# EAGLE design untitled1 (EAGLE 5.07)
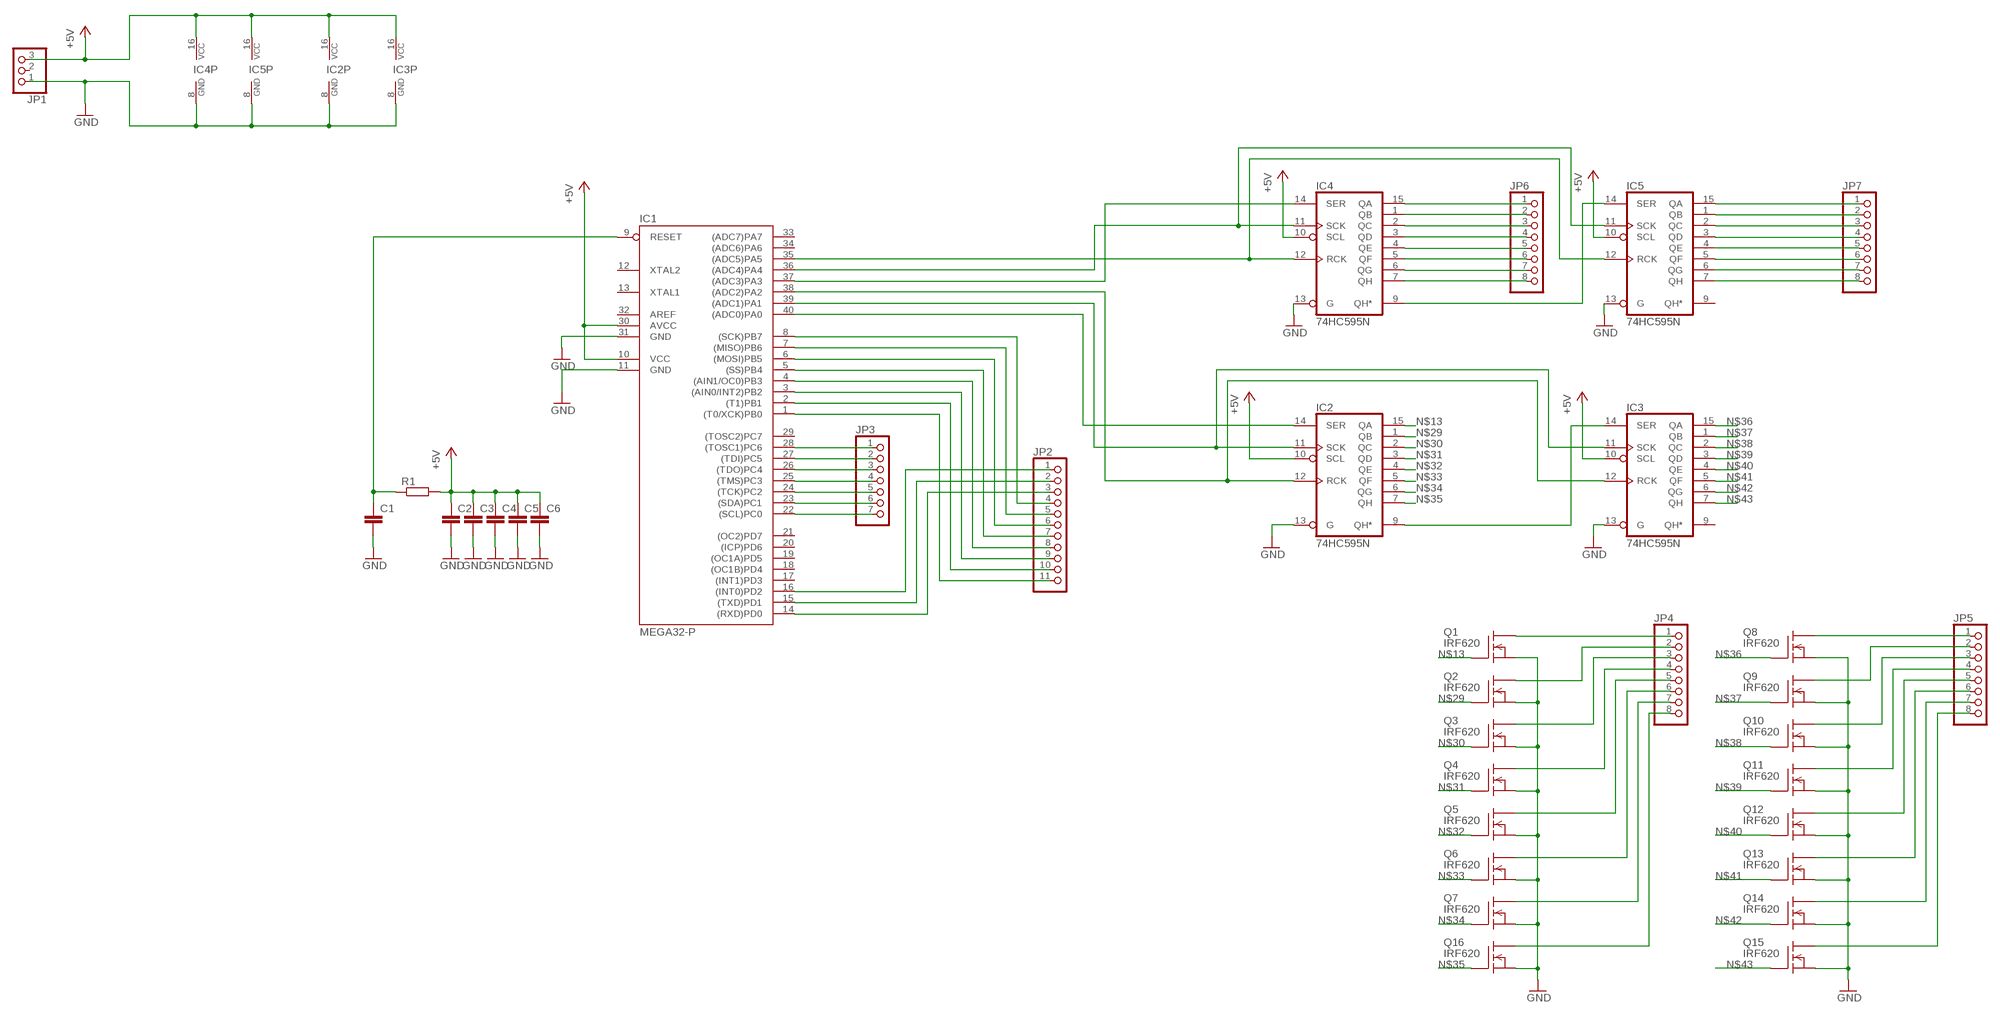
[diagram p0: schematic, sheet 1]

## Parts
C1  C-EU050-024X044  [C050-024X044]
C2  C-EU050-024X044  [C050-024X044]
C3  C-EU050-024X044  [C050-024X044]
C4  C-EU050-024X044  [C050-024X044]
C5  C-EU050-024X044  [C050-024X044]
C6  C-EU050-024X044  [C050-024X044]
IC1  MEGA32-P  [DIL40]
IC2  74HC595N  [DIL16]
IC3  74HC595N  [DIL16]
IC4  74HC595N  [DIL16]
IC5  74HC595N  [DIL16]
JP1  PINHD-1X3/90  [1X03/90]
JP2  PINHD-1X11/90  [1X11/90]
JP3  PINHD-1X7/90  [1X07/90]
JP4  PINHD-1X8/90  [1X08/90]
JP5  PINHD-1X8/90  [1X08/90]
JP6  PINHD-1X8/90  [1X08/90]
JP7  PINHD-1X8/90  [1X08/90]
Q1  IRF620  [TO220]
Q2  IRF620  [TO220]
Q3  IRF620  [TO220]
Q4  IRF620  [TO220]
Q5  IRF620  [TO220]
Q6  IRF620  [TO220]
Q7  IRF620  [TO220]
Q8  IRF620  [TO220]
Q9  IRF620  [TO220]
Q10  IRF620  [TO220]
Q11  IRF620  [TO220]
Q12  IRF620  [TO220]
Q13  IRF620  [TO220]
Q14  IRF620  [TO220]
Q15  IRF620  [TO220]
Q16  IRF620  [TO220]
R1  R-EU_0204/7  [0204/7]

## Nets
+5V: C2.1 C3.1 C4.1 C5.1 C6.1 IC1.10(VCC) IC1.30(AVCC) IC2.10(SCL) IC2.16(VCC) IC3.10(SCL) IC3.16(VCC) IC4.10(SCL) IC4.16(VCC) IC5.10(SCL) IC5.16(VCC) JP1.3 R1.2
GND: C1.2 C2.2 C3.2 C4.2 C5.2 C6.2 IC1.11(GND) IC1.31(GND) IC2.8(GND) IC2.13(G) IC3.8(GND) IC3.13(G) IC4.8(GND) IC4.13(G) IC5.8(GND) IC5.13(G) JP1.1 Q1.3(S) Q2.3(S) Q3.3(S) Q4.3(S) Q5.3(S) Q6.3(S) Q7.3(S) Q8.3(S) Q9.3(S) Q10.3(S) Q11.3(S) Q12.3(S) Q13.3(S) Q14.3(S) Q15.3(S) Q16.3(S)
N$1: IC2.9(QH*) IC3.14(SER)
N$2: IC1.40((ADC0)PA0) IC2.14(SER)
N$3: IC1.39((ADC1)PA1) IC2.11(SCK) IC3.11(SCK)
N$4: IC1.38((ADC2)PA2) IC2.12(RCK) IC3.12(RCK)
N$5: IC1.37((ADC3)PA3) IC4.14(SER)
N$6: IC1.36((ADC4)PA4) IC4.11(SCK) IC5.11(SCK)
N$7: IC1.35((ADC5)PA5) IC4.12(RCK) IC5.12(RCK)
N$8: IC4.9(QH*) IC5.14(SER)
N$9: C1.1 IC1.9(RESET) R1.1
N$10: IC1.14((RXD)PD0) JP2.3
N$11: IC1.15((TXD)PD1) JP2.2
N$12: IC1.16((INT0)PD2) JP2.1
N$13: IC2.15(QA) Q1.1(G)
N$14: IC1.8((SCK)PB7) JP2.4
N$15: IC1.7((MISO)PB6) JP2.5
N$16: IC1.6((MOSI)PB5) JP2.6
N$17: IC1.5((SS)PB4) JP2.7
N$18: IC1.4((AIN1/OC0)PB3) JP2.8
N$19: IC1.3((AIN0/INT2)PB2) JP2.9
N$20: IC1.2((T1)PB1) JP2.10
N$21: IC1.1((T0/XCK)PB0) JP2.11
N$22: IC1.22((SCL)PC0) JP3.7
N$23: IC1.23((SDA)PC1) JP3.6
N$24: IC1.24((TCK)PC2) JP3.5
N$25: IC1.25((TMS)PC3) JP3.4
N$26: IC1.26((TDO)PC4) JP3.3
N$27: IC1.27((TDI)PC5) JP3.2
N$28: IC1.28((TOSC1)PC6) JP3.1
N$29: IC2.1(QB) Q2.1(G)
N$30: IC2.2(QC) Q3.1(G)
N$31: IC2.3(QD) Q4.1(G)
N$32: IC2.4(QE) Q5.1(G)
N$33: IC2.5(QF) Q6.1(G)
N$34: IC2.6(QG) Q7.1(G)
N$35: IC2.7(QH) Q16.1(G)
N$36: IC3.15(QA) Q8.1(G)
N$37: IC3.1(QB) Q9.1(G)
N$38: IC3.2(QC) Q10.1(G)
N$39: IC3.3(QD) Q11.1(G)
N$40: IC3.4(QE) Q12.1(G)
N$41: IC3.5(QF) Q13.1(G)
N$42: IC3.6(QG) Q14.1(G)
N$43: IC3.7(QH) Q15.1(G)
N$44: JP4.1 Q1.2(D)
N$45: JP4.2 Q2.2(D)
N$46: JP4.3 Q3.2(D)
N$47: JP4.4 Q4.2(D)
N$48: JP4.5 Q5.2(D)
N$49: JP4.6 Q6.2(D)
N$50: JP4.7 Q7.2(D)
N$51: JP4.8 Q16.2(D)
N$52: JP5.1 Q8.2(D)
N$53: JP5.2 Q9.2(D)
N$54: JP5.3 Q10.2(D)
N$55: JP5.4 Q11.2(D)
N$56: JP5.5 Q12.2(D)
N$57: JP5.6 Q13.2(D)
N$58: JP5.7 Q14.2(D)
N$59: JP5.8 Q15.2(D)
N$60: IC4.15(QA) JP6.1
N$61: IC4.1(QB) JP6.2
N$62: IC4.2(QC) JP6.3
N$63: IC4.3(QD) JP6.4
N$64: IC4.4(QE) JP6.5
N$65: IC4.5(QF) JP6.6
N$66: IC4.6(QG) JP6.7
N$67: IC4.7(QH) JP6.8
N$68: IC5.15(QA) JP7.1
N$69: IC5.1(QB) JP7.2
N$70: IC5.2(QC) JP7.3
N$71: IC5.3(QD) JP7.4
N$72: IC5.4(QE) JP7.5
N$73: IC5.5(QF) JP7.6
N$74: IC5.6(QG) JP7.7
N$75: IC5.7(QH) JP7.8
Unconnected: IC1.12(XTAL2) IC1.13(XTAL1) IC1.17((INT1)PD3) IC1.18((OC1B)PD4) IC1.19((OC1A)PD5) IC1.20((ICP)PD6) IC1.21((OC2)PD7) IC1.29((TOSC2)PC7) IC1.32(AREF) IC1.33((ADC7)PA7) IC1.34((ADC6)PA6) IC3.9(QH*) IC5.9(QH*) JP1.2

## Library data of the parts
C1-C6 = rcl:C-EU: CAPACITOR, European symbol
IC1 = atmel:MEGA32-P: MICROCONTROLLER 32 Kbytes FLASH 2 Kbytes SRAM 1 Kbytes EEPROM USART 8-channel 10 bit ADC Source: www.atmel.com .. doc2503.pdf
IC2-IC5 = 74xx-eu:74*595: 8-bit SHIFT REGISTER, output latch
JP1 = pinhead:PINHD-1X3: PIN HEADER
JP2 = pinhead:PINHD-1X11: PIN HEADER
JP3 = pinhead:PINHD-1X7: PIN HEADER
JP4-JP7 = pinhead:PINHD-1X8: PIN HEADER
Q1-Q16 = transistor-fet:IRF620: N-Channel Enhancement MOSFET (HEXFET); 200V; 5,2A; 0,8Ohm
R1 = rcl:R-EU_: RESISTOR, European symbol

## Board
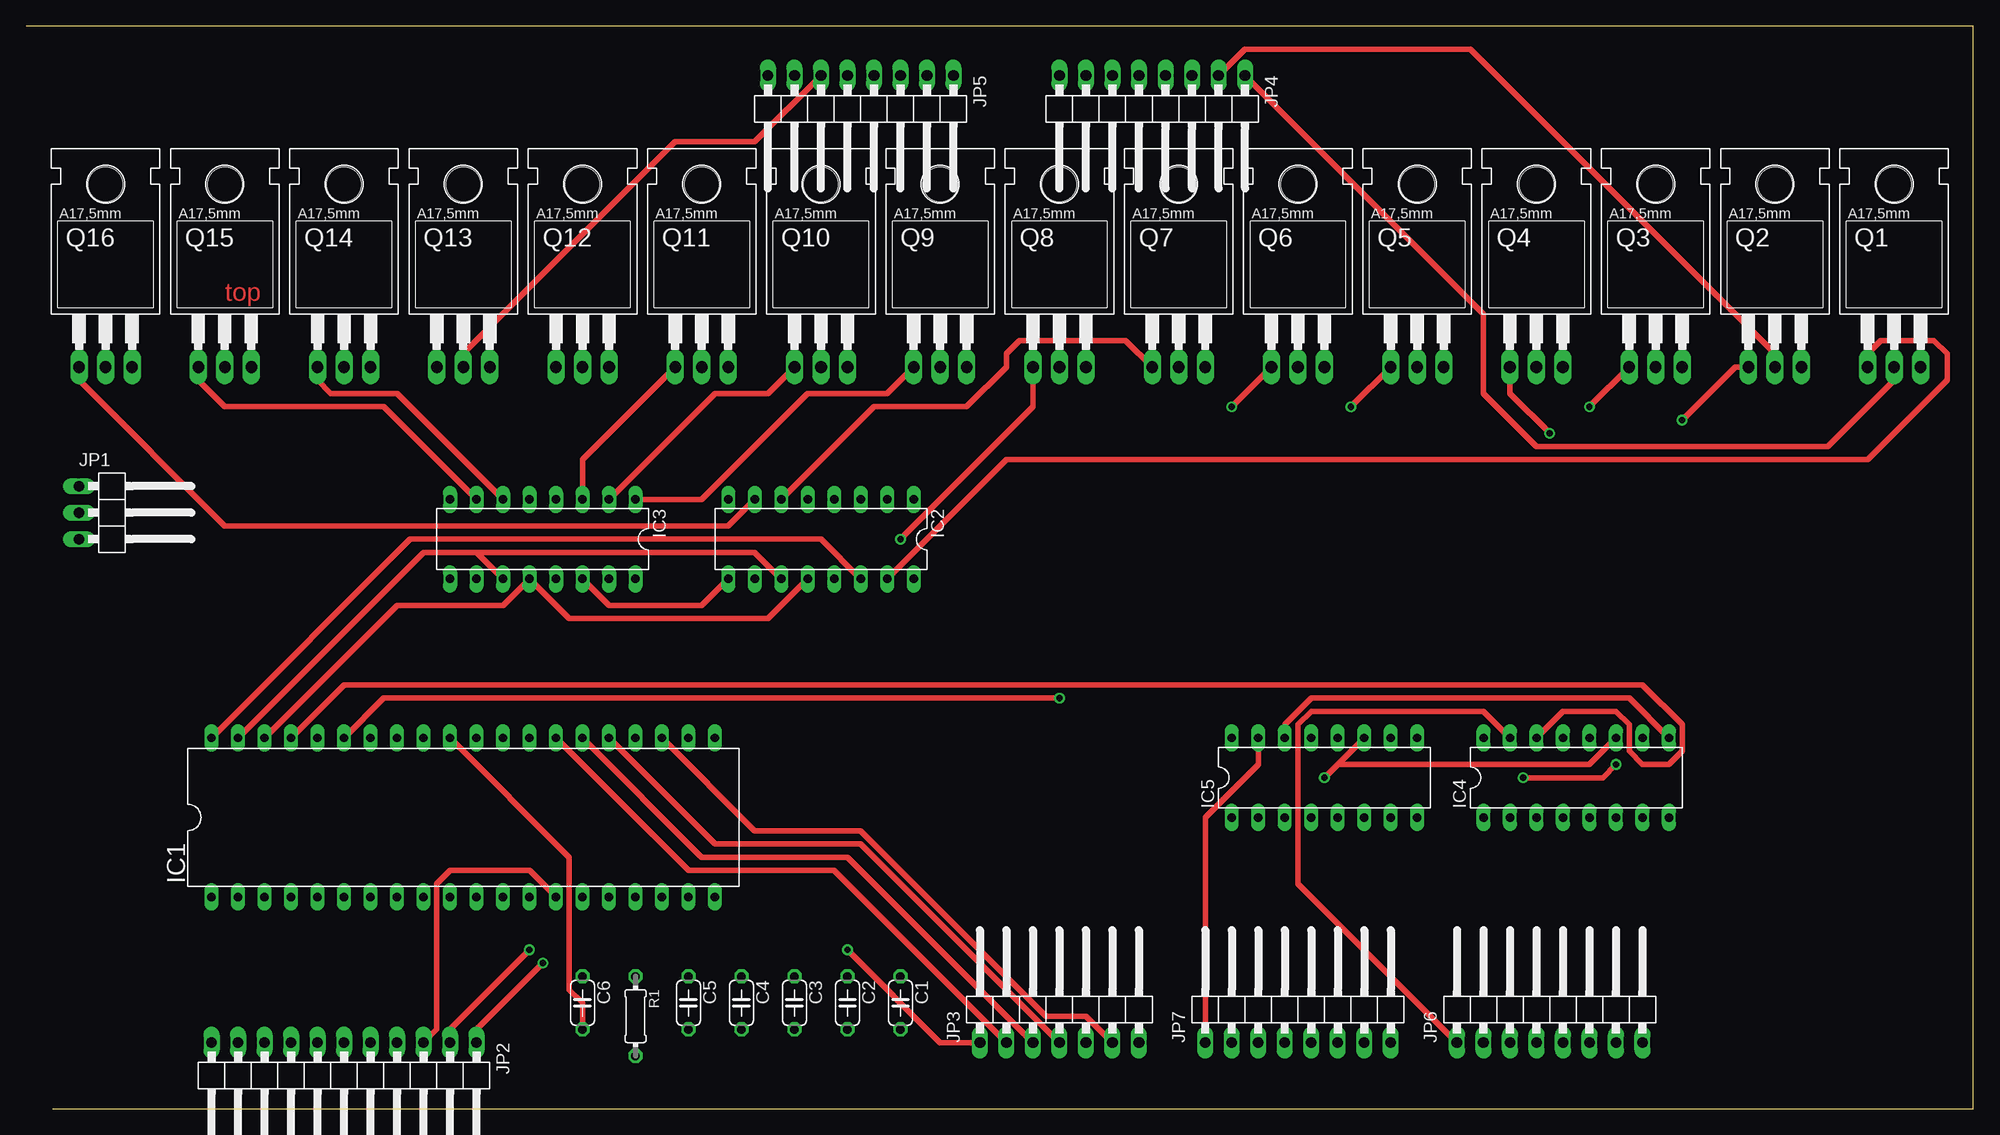
[diagram p1: board, top side]
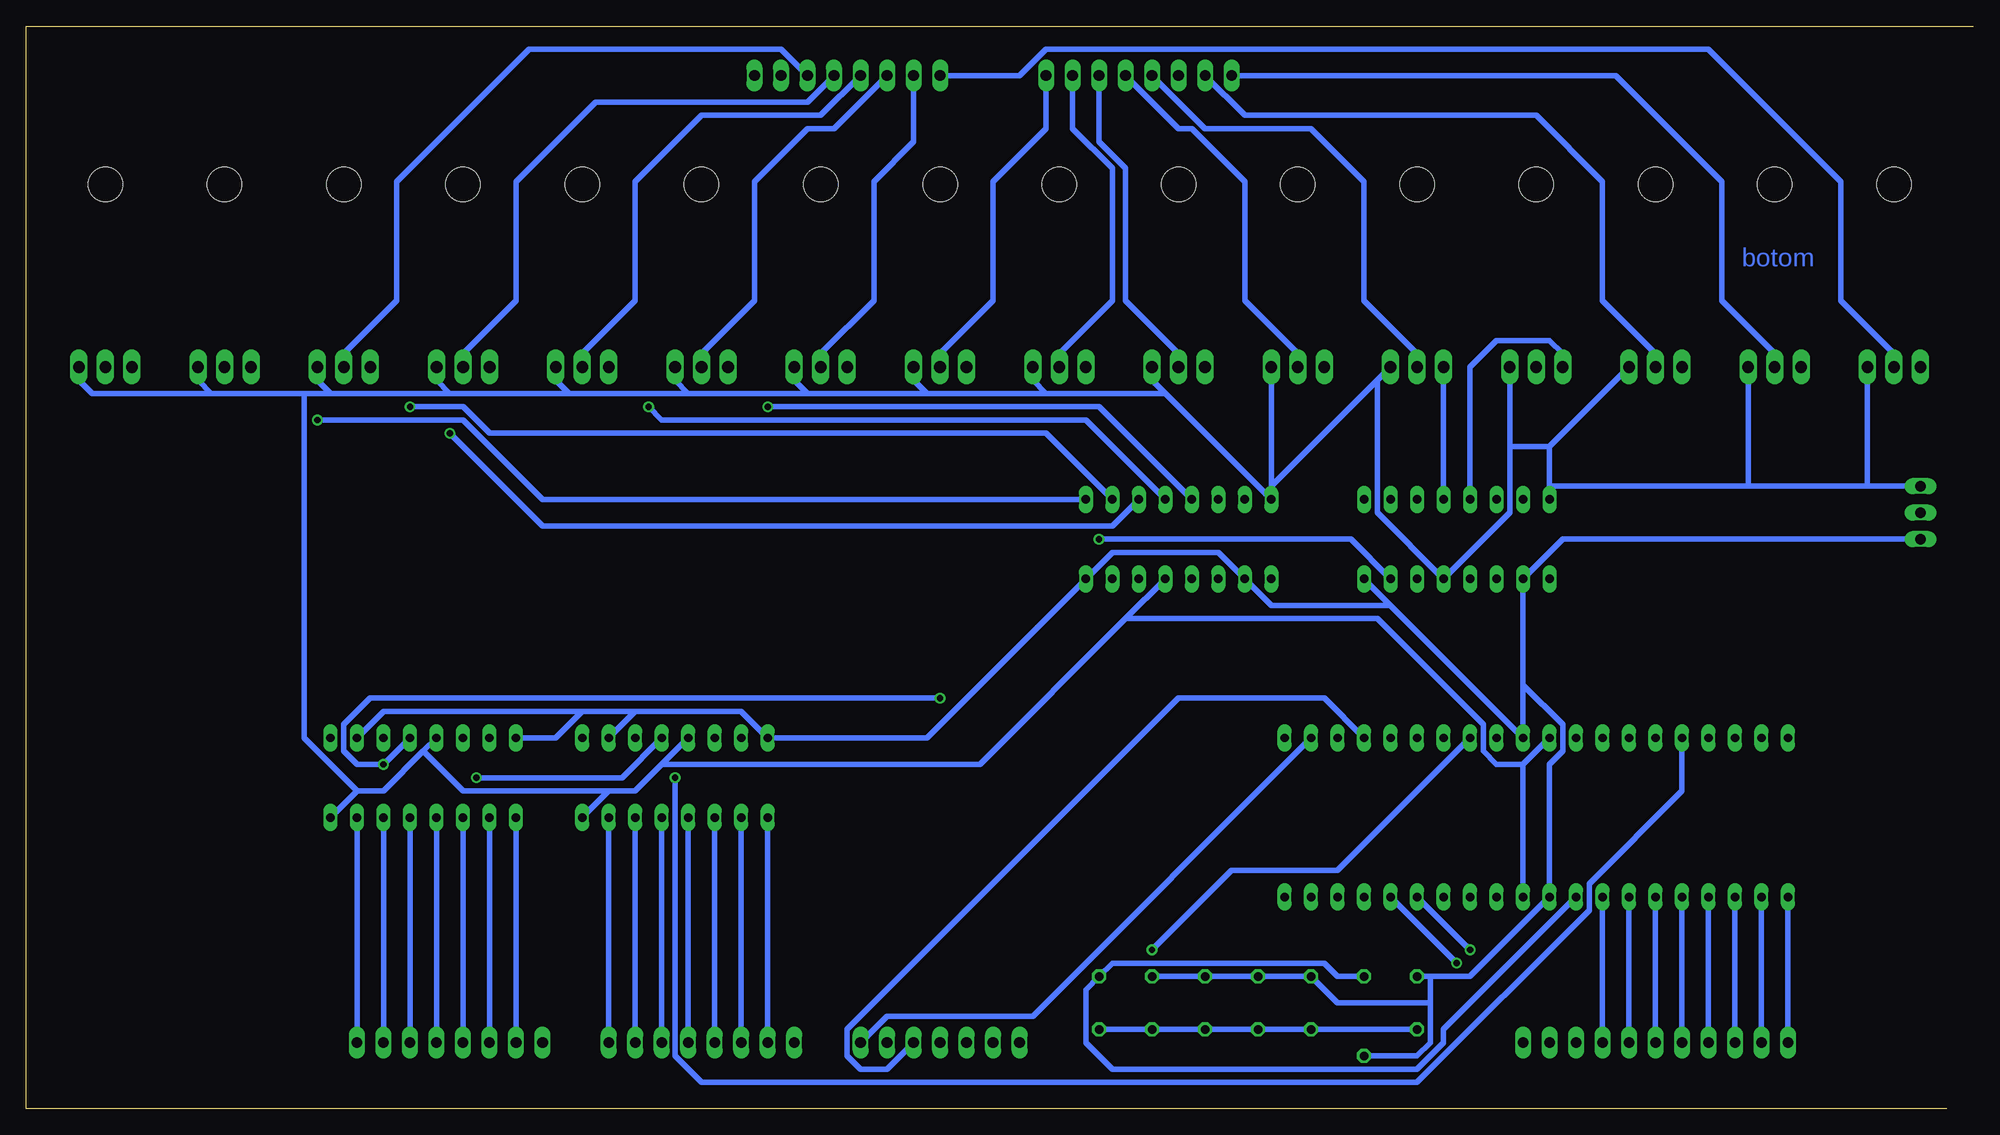
[diagram p2: board, bottom side, seen from below]

Size 186.67 x 103.81 mm. Coordinates in mm from the lower left corner, seen from the top.
Outline: 2.54,0 186.67,0 186.67,103.81 0,103.81
Copper layers (1*16): Top 0.035mm / dielectric 1.5mm / Bottom 0.035mm
Design rules "default *": minimum track width 20mil, minimum drill 24mil, track to track 8mil, track to pad 8mil, pad to pad 8mil, via to via 8mil, smd to smd 8mil, copper to edge 40mil, drill to drill 8mil, minimum pad ring 10mil, minimum via ring 8mil, stop-mask expansion 4mil, vias tented up to drill 0mil, thermal gap 10mil

### Footprints (pad centres in the part's own frame; a part is rotated, then mirrored left to right if it is on the bottom)
C050-024X044 = drill 0.813 octagon: 1 -2.54,0; 2 2.54,0
DIL40 = drill 0.813 long: 1 -24.13,-7.62; 2 -21.59,-7.62; 3 -19.05,-7.62; 4 -16.51,-7.62; 5 -13.97,-7.62; 6 -11.43,-7.62; 7 -8.89,-7.62; 8 -6.35,-7.62; 9 -3.81,-7.62; 10 -1.27,-7.62; 11 1.27,-7.62; 12 3.81,-7.62; 13 6.35,-7.62; 14 8.89,-7.62; 15 11.43,-7.62; 16 13.97,-7.62; 17 16.51,-7.62; 18 19.05,-7.62; 19 21.59,-7.62; 20 24.13,-7.62; 21 24.13,7.62; 22 21.59,7.62; 23 19.05,7.62; 24 16.51,7.62; 25 13.97,7.62; 26 11.43,7.62; 27 8.89,7.62; 28 6.35,7.62; 29 3.81,7.62; 30 1.27,7.62; 31 -1.27,7.62; 32 -3.81,7.62; 33 -6.35,7.62; 34 -8.89,7.62; 35 -11.43,7.62; 36 -13.97,7.62; 37 -16.51,7.62; 38 -19.05,7.62; 39 -21.59,7.62; 40 -24.13,7.62
DIL16 = drill 0.813 long: 1 -8.89,-3.81; 2 -6.35,-3.81; 3 -3.81,-3.81; 4 -1.27,-3.81; 5 1.27,-3.81; 6 3.81,-3.81; 7 6.35,-3.81; 8 8.89,-3.81; 9 8.89,3.81; 10 6.35,3.81; 11 3.81,3.81; 12 1.27,3.81; 13 -1.27,3.81; 14 -3.81,3.81; 15 -6.35,3.81; 16 -8.89,3.81
1X03/90 = drill 1.016 long: 1 -2.54,-3.81; 2 0,-3.81; 3 2.54,-3.81
1X11/90 = drill 1.016 long: 1 -12.7,-3.81; 2 -10.16,-3.81; 3 -7.62,-3.81; 4 -5.08,-3.81; 5 -2.54,-3.81; 6 0,-3.81; 7 2.54,-3.81; 8 5.08,-3.81; 9 7.62,-3.81; 10 10.16,-3.81; 11 12.7,-3.81
1X07/90 = drill 1.016 long: 1 -7.62,-3.81; 2 -5.08,-3.81; 3 -2.54,-3.81; 4 0,-3.81; 5 2.54,-3.81; 6 5.08,-3.81; 7 7.62,-3.81
1X08/90 = drill 1.016 long: 1 -8.89,-3.81; 2 -6.35,-3.81; 3 -3.81,-3.81; 4 -1.27,-3.81; 5 1.27,-3.81; 6 3.81,-3.81; 7 6.35,-3.81; 8 8.89,-3.81
TO220 = drill 1.118 long: 1 -2.54,-6.35; 2 0,-6.35; 3 2.54,-6.35 | hole 3.302: 0,11.176
0204/7 = drill 0.813 octagon: 1 -3.81,0; 2 3.81,0

### Placement (x,y rotation side)
C1  83.82,10.16 270 top
C2  78.74,10.16 270 top
C3  73.66,10.16 270 top
C4  68.58,10.16 270 top
C5  63.5,10.16 270 top
C6  53.34,10.16 270 top
IC1  41.91,27.94 0 top
IC2  76.2,54.61 180 top
IC3  49.53,54.61 180 top
IC4  148.59,31.75 0 top
IC5  124.46,31.75 0 top
JP1  8.89,57.15 270 top
JP2  30.48,2.54 180 top
JP3  99.06,10.16 0 top
JP4  107.95,95.25 180 top
JP5  80.01,95.25 180 top
JP6  146.05,10.16 0 top
JP7  121.92,10.16 0 top
Q1  179.07,77.47 0 top
Q2  167.64,77.47 0 top
Q3  156.21,77.47 0 top
Q4  144.78,77.47 0 top
Q5  133.35,77.47 0 top
Q6  121.92,77.47 0 top
Q7  110.49,77.47 0 top
Q8  99.06,77.47 0 top
Q9  87.63,77.47 0 top
Q10  76.2,77.47 0 top
Q11  64.77,77.47 0 top
Q12  53.34,77.47 0 top
Q13  41.91,77.47 0 top
Q14  30.48,77.47 0 top
Q15  19.05,77.47 0 top
Q16  7.62,77.47 0 top
R1  58.42,8.89 270 top

### Tracks (layer width: path | path; a pad name or v marks a point on that pad's centre or on a via)
+5V
  Bottom 0.508: C2.1 C3.1 C4.1 C5.1 60.96,10.16 52.07,10.16 | 52.07,12.7 C6.1 | 52.07,12.7 48.26,12.7 IC1.10 40.64,33.02 39.37,34.29 39.37,36.83 43.18,40.64 | R1.2 53.34,5.08 52.07,6.35 52.07,10.16 | 52.07,10.16 52.07,12.7 | 128.27,38.1 118.11,38.1 IC5.16 100.33,35.56 IC2.16 82.55,53.34 72.39,53.34 IC2.10 67.31,48.26 55.88,48.26 | 128.27,38.1 IC5.10 | IC4.16 135.89,35.56 133.35,38.1 | 128.27,38.1 133.35,38.1 | IC4.10 152.4,38.1 133.35,38.1 | 43.18,40.64 IC3.10 39.37,54.61 JP1.3 | 43.18,40.64 IC1.30 55.88,48.26 | 55.88,48.26 IC3.16
GND
  Top 0.508: C6.2 53.34,10.16 52.07,11.43 52.07,24.13 IC1.31
  Bottom 0.508: C6.2 C5.2 C4.2 C3.2 C2.2 C1.2 | 148.59,34.29 152.4,30.48 154.94,30.48 | 148.59,34.29 IC4.13 | 154.94,30.48 IC4.8 | IC1.31 43.18,33.02 | 43.18,33.02 IC1.11 | 125.73,33.02 128.27,30.48 130.81,30.48 | 125.73,33.02 IC5.13 | 130.81,30.48 IC5.8 | 81.28,46.99 95.25,33.02 125.73,33.02 | 81.28,46.99 IC2.13 | 43.18,33.02 45.72,33.02 46.99,34.29 46.99,36.83 57.15,46.99 81.28,46.99 | 148.59,34.29 144.78,30.48 130.81,30.48 | 44.45,63.5 Q13.3 | 44.45,63.5 44.45,57.15 IC3.13 57.15,57.15 57.15,69.85 | 40.64,63.5 40.64,59.69 | 40.64,63.5 Q14.3 | 40.64,59.69 21.59,59.69 | 21.59,59.69 10.16,59.69 | 10.16,59.69 JP1.1 | 40.64,59.69 IC3.8 | 10.16,59.69 Q16.3 | 21.59,59.69 Q15.3 | 44.45,63.5 40.64,63.5 | 67.31,59.69 Q11.3 | 67.31,59.69 57.15,69.85 | 57.15,69.85 Q12.3 | 67.31,59.69 IC2.8 77.47,68.58 | Q10.3 78.74,69.85 77.47,68.58 | Q9.3 90.17,69.85 88.9,68.58 | 88.9,68.58 77.47,68.58 | Q8.3 101.6,69.85 100.33,68.58 | 100.33,68.58 88.9,68.58 | Q7.3 113.03,69.85 111.76,68.58 | 111.76,68.58 100.33,68.58 | Q6.3 124.46,69.85 123.19,68.58 | 123.19,68.58 111.76,68.58 | Q5.3 135.89,69.85 134.62,68.58 | 134.62,68.58 123.19,68.58 | Q4.3 147.32,69.85 146.05,68.58 | 146.05,68.58 134.62,68.58 | Q3.3 158.75,69.85 157.48,68.58 | 157.48,68.58 146.05,68.58 | Q2.3 170.18,69.85 168.91,68.58 | 160.02,68.58 157.48,68.58 | 160.02,68.58 168.91,68.58 | Q1.3 181.61,69.85 180.34,68.58 168.91,68.58 | 154.94,30.48 160.02,35.56 160.02,68.58
N$1
  Top 0.508: IC3.14 55.88,48.26 64.77,48.26 IC2.9
N$2
  Top 0.508: IC1.40 36.83,54.61 76.2,54.61 IC2.14
N$3
  Top 0.508: IC1.39 38.1,53.34 43.18,53.34 | 43.18,53.34 IC3.11 | IC2.11 69.85,53.34 43.18,53.34
N$4
  Top 0.508: IC1.38 35.56,48.26 45.72,48.26 IC3.12 52.07,46.99 71.12,46.99 IC2.12
N$5
  Top 0.508: IC1.37 30.48,40.64 154.94,40.64 158.75,36.83 158.75,34.29 157.48,33.02 154.94,33.02 153.67,34.29 153.67,36.83 152.4,38.1 147.32,38.1 IC4.14
N$6  (via drill 0.61)
  Top 0.508: 125.73,33.02 IC5.11 | v124.46,31.75 125.73,33.02 | IC4.11 149.86,33.02 125.73,33.02
  Bottom 0.508: IC1.36 27.94,30.48 36.83,21.59 36.83,19.05 53.34,2.54 121.92,2.54 124.46,5.08 v124.46,31.75
N$7  (via drill 0.61)
  Top 0.508: IC1.35 34.29,39.37 v99.06,39.37 | v143.51,31.75 151.13,31.75 v152.4,33.02
  Bottom 0.508: v99.06,39.37 153.67,39.37 156.21,36.83 156.21,34.29 154.94,33.02 v152.4,33.02 IC4.12 | IC5.12 129.54,31.75 v143.51,31.75
N$8
  Top 0.508: IC5.14 120.65,36.83 123.19,39.37 153.67,39.37 IC4.9
N$9
  Bottom 0.508: IC1.9 50.8,7.62 50.8,6.35 53.34,3.81 82.55,3.81 85.09,6.35 85.09,11.43 C1.1 82.55,13.97 62.23,13.97 60.96,12.7 R1.1
N$10
  Top 0.508: IC1.14 48.26,22.86 40.64,22.86 39.37,21.59 39.37,7.62 JP2.3
N$11  (via drill 0.61)
  Top 0.508: v48.26,15.24 40.64,7.62 JP2.2
  Bottom 0.508: v48.26,15.24 IC1.15
N$12  (via drill 0.61)
  Top 0.508: v49.53,13.97 43.18,7.62 JP2.1
  Bottom 0.508: v49.53,13.97 IC1.16
N$13
  Top 0.508: IC2.15 93.98,62.23 176.53,62.23 184.15,69.85 184.15,72.39 182.88,73.66 177.8,73.66 176.53,72.39 Q1.1
N$14
  Bottom 0.508: JP2.4 IC1.8
N$15
  Bottom 0.508: JP2.5 IC1.7
N$16
  Bottom 0.508: JP2.6 IC1.6
N$17
  Bottom 0.508: JP2.7 IC1.5
N$18
  Bottom 0.508: JP2.8 IC1.4
N$19
  Bottom 0.508: JP2.9 IC1.3
N$20
  Bottom 0.508: JP2.10 IC1.2
N$21
  Bottom 0.508: JP2.11 IC1.1
N$22
  Bottom 0.508: IC1.22 90.17,8.89 104.14,8.89 JP3.7
N$23
  Top 0.508: IC1.23 69.85,26.67 80.01,26.67 97.79,8.89 101.6,8.89 JP3.6
N$24
  Bottom 0.508: IC1.24 62.23,39.37 76.2,39.37 107.95,7.62 107.95,5.08 106.68,3.81 104.14,3.81 JP3.5
N$25
  Top 0.508: IC1.25 66.04,25.4 80.01,25.4 JP3.4
N$26
  Top 0.508: IC1.26 64.77,24.13 78.74,24.13 JP3.3
N$27
  Top 0.508: IC1.27 63.5,22.86 77.47,22.86 JP3.2
N$28  (via drill 0.61)
  Top 0.508: v78.74,15.24 87.63,6.35 JP3.1
  Bottom 0.508: IC1.28 60.96,22.86 71.12,22.86 v78.74,15.24
N$29  (via drill 0.61)
  Top 0.508: v158.75,66.04 163.83,71.12 Q2.1
  Bottom 0.508: IC2.1 137.16,58.42 144.78,66.04 v158.75,66.04
N$30  (via drill 0.61)
  Top 0.508: v149.86,67.31 Q3.1
  Bottom 0.508: IC2.2 88.9,64.77 142.24,64.77 144.78,67.31 v149.86,67.31
N$31  (via drill 0.61)
  Top 0.508: v146.05,64.77 142.24,68.58 Q4.1
  Bottom 0.508: IC2.3 82.55,55.88 137.16,55.88 v146.05,64.77
N$32  (via drill 0.61)
  Top 0.508: v127,67.31 Q5.1
  Bottom 0.508: IC2.4 85.09,66.04 125.73,66.04 v127,67.31
N$33  (via drill 0.61)
  Top 0.508: v115.57,67.31 Q6.1
  Bottom 0.508: IC2.5 83.82,67.31 v115.57,67.31
N$34
  Top 0.508: IC2.6 81.28,67.31 90.17,67.31 93.98,71.12 93.98,72.39 95.25,73.66 105.41,73.66 Q7.1
N$35
  Top 0.508: IC2.7 67.31,55.88 19.05,55.88 5.08,69.85 Q16.1
N$36  (via drill 0.61)
  Top 0.508: v83.82,54.61 96.52,67.31 Q8.1
  Bottom 0.508: IC3.15 59.69,54.61 v83.82,54.61
N$37
  Top 0.508: IC3.1 64.77,58.42 74.93,68.58 82.55,68.58 Q9.1
N$38
  Top 0.508: IC3.2 66.04,68.58 71.12,68.58 Q10.1
N$39
  Top 0.508: IC3.3 53.34,62.23 Q11.1
N$40
  Bottom 0.508: IC3.4 Q12.1
N$41
  Bottom 0.508: IC3.5 48.26,71.12 45.72,73.66 40.64,73.66 39.37,72.39 Q13.1
N$42
  Top 0.508: IC3.6 35.56,68.58 29.21,68.58 27.94,69.85 Q14.1
N$43
  Top 0.508: IC3.7 34.29,67.31 19.05,67.31 16.51,69.85 Q15.1
N$44
  Top 0.508: JP4.1 139.7,76.2 139.7,68.58 144.78,63.5 172.72,63.5 179.07,69.85 Q1.2
N$45
  Top 0.508: JP4.2 116.84,101.6 138.43,101.6 167.64,72.39 Q2.2
N$46
  Bottom 0.508: JP4.3 114.3,101.6 138.43,101.6 151.13,88.9 151.13,77.47 156.21,72.39 Q3.2
N$47
  Bottom 0.508: JP4.4 111.76,96.52 132.08,96.52 139.7,88.9 139.7,77.47 144.78,72.39 Q4.2
N$48
  Bottom 0.508: JP4.5 110.49,95.25 121.92,95.25 128.27,88.9 128.27,77.47 133.35,72.39 Q5.2
N$49
  Bottom 0.508: JP4.6 109.22,93.98 111.76,93.98 116.84,88.9 116.84,77.47 121.92,72.39 Q6.2
N$50
  Bottom 0.508: JP4.7 101.6,92.71 105.41,88.9 105.41,77.47 110.49,72.39 Q7.2
N$51
  Bottom 0.508: JP4.8 91.44,99.06 88.9,101.6 25.4,101.6 12.7,88.9 12.7,77.47 7.62,72.39 Q16.2
N$52
  Bottom 0.508: JP5.1 88.9,93.98 93.98,88.9 93.98,77.47 99.06,72.39 Q8.2
N$53
  Bottom 0.508: JP5.2 86.36,93.98 82.55,90.17 82.55,77.47 87.63,72.39 Q9.2
N$54
  Bottom 0.508: JP5.3 83.82,92.71 81.28,90.17 81.28,77.47 76.2,72.39 Q10.2
N$55
  Bottom 0.508: JP5.4 76.2,93.98 74.93,93.98 69.85,88.9 69.85,77.47 64.77,72.39 Q11.2
N$56
  Bottom 0.508: JP5.5 73.66,93.98 63.5,93.98 58.42,88.9 58.42,77.47 53.34,72.39 Q12.2
N$57
  Top 0.508: JP5.6 69.85,92.71 62.23,92.71 41.91,72.39 Q13.2
N$58
  Bottom 0.508: JP5.7 69.85,95.25 41.91,95.25 35.56,88.9 35.56,77.47 30.48,72.39 Q14.2
N$59
  Bottom 0.508: JP5.8 34.29,99.06 24.13,88.9 24.13,77.47 19.05,72.39 Q15.2
N$60
  Top 0.508: IC4.15 139.7,38.1 123.19,38.1 121.92,36.83 121.92,21.59 JP6.1
N$61
  Bottom 0.508: JP6.2 IC4.1
N$62
  Bottom 0.508: JP6.3 IC4.2
N$63
  Bottom 0.508: JP6.4 IC4.3
N$64
  Bottom 0.508: JP6.5 IC4.4
N$65
  Bottom 0.508: JP6.6 IC4.5
N$66
  Bottom 0.508: JP6.7 IC4.6
N$67
  Bottom 0.508: JP6.8 IC4.7
N$68
  Top 0.508: IC5.15 118.11,33.02 113.03,27.94 JP7.1
N$69
  Bottom 0.508: JP7.2 IC5.1
N$70
  Bottom 0.508: JP7.3 IC5.2
N$71
  Bottom 0.508: JP7.4 IC5.3
N$72
  Bottom 0.508: JP7.5 IC5.4
N$73
  Bottom 0.508: JP7.6 IC5.5
N$74
  Bottom 0.508: JP7.7 IC5.6
N$75
  Bottom 0.508: JP7.8 IC5.7

### Text on the board
Top: top
Bottom: botom